# EAGLE design FRA_bulkhead_v1 (EAGLE 9.5.2)
CNAME: FRA universal bulkhead; CREVISION: 01
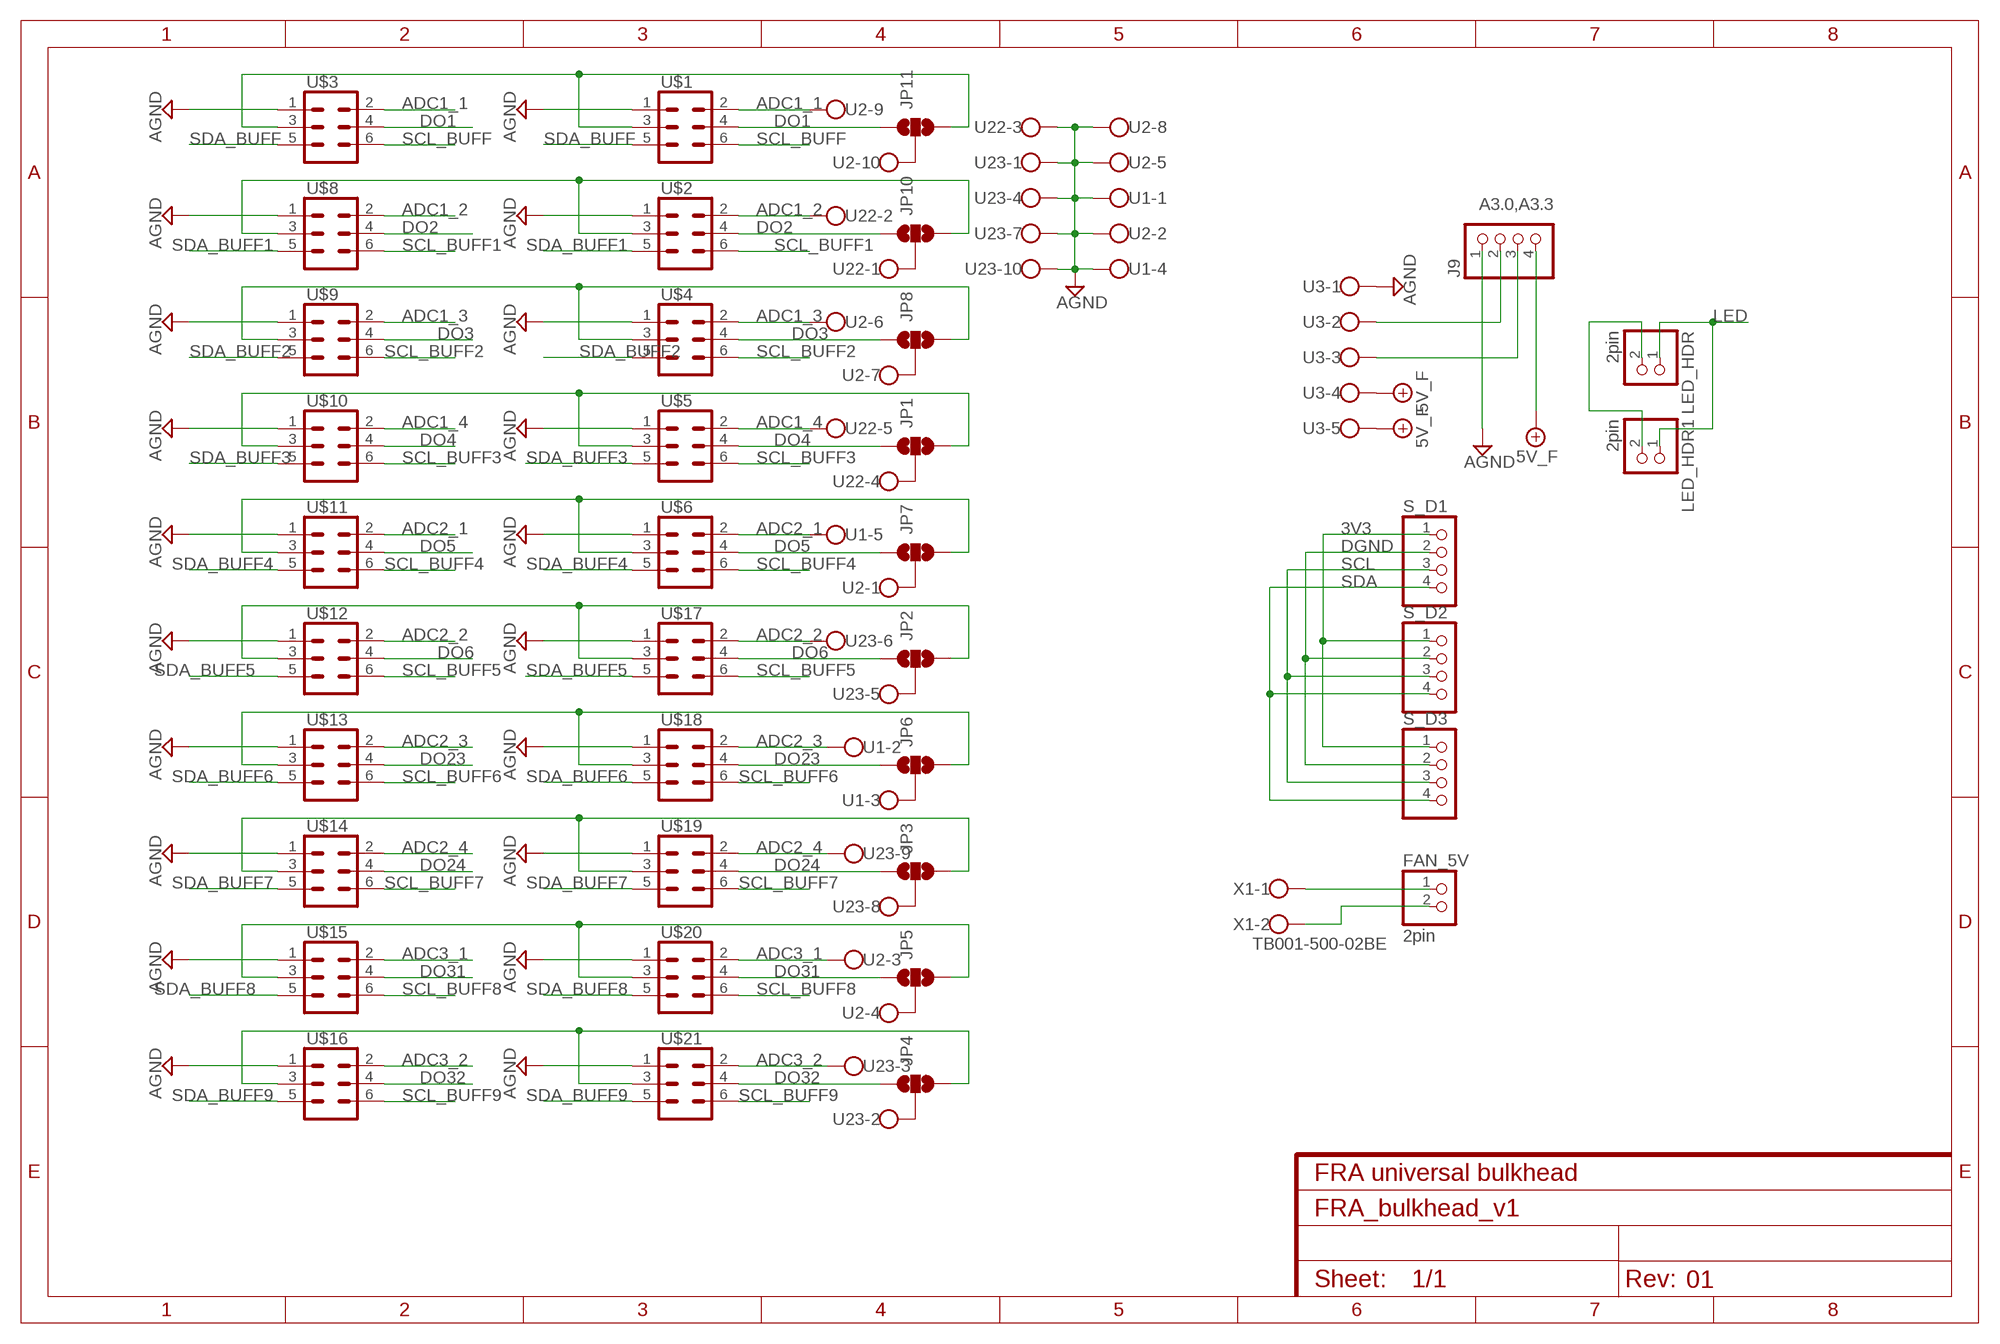
[diagram p0: schematic, sheet 1]

## Parts
FAN_5V  2pin  PINHD-1X2  [1X02]
J9  4pin  PINHD-1X4  [1X04]
JP1  JUMPER-SMT_3_NO_NO_SILK  [SMT-JUMPER_3_0-NO_TRACE_NO-SILK]
JP2  JUMPER-SMT_3_NO_NO_SILK  [SMT-JUMPER_3_0-NO_TRACE_NO-SILK]
JP3  JUMPER-SMT_3_NO_NO_SILK  [SMT-JUMPER_3_0-NO_TRACE_NO-SILK]
JP4  JUMPER-SMT_3_NO_NO_SILK  [SMT-JUMPER_3_0-NO_TRACE_NO-SILK]
JP5  JUMPER-SMT_3_NO_NO_SILK  [SMT-JUMPER_3_0-NO_TRACE_NO-SILK]
JP6  JUMPER-SMT_3_NO_NO_SILK  [SMT-JUMPER_3_0-NO_TRACE_NO-SILK]
JP7  JUMPER-SMT_3_NO_NO_SILK  [SMT-JUMPER_3_0-NO_TRACE_NO-SILK]
JP8  JUMPER-SMT_3_NO_NO_SILK  [SMT-JUMPER_3_0-NO_TRACE_NO-SILK]
JP10  JUMPER-SMT_3_NO_NO_SILK  [SMT-JUMPER_3_0-NO_TRACE_NO-SILK]
JP11  JUMPER-SMT_3_NO_NO_SILK  [SMT-JUMPER_3_0-NO_TRACE_NO-SILK]
LED_HDR  2pin  PINHD-1X2  [1X02]
LED_HDR1  2pin  PINHD-1X2  [1X02]
S_D1  4pin  PINHD-1X4  [1X04]
S_D2  4pin  PINHD-1X4  [1X04]
S_D3  4pin  PINHD-1X4  [1X04]
U1  TB003V-500-P05BERIGHTANGLE-NORMAL  [TB003-500-P05BE]
U2  TB003V-500-P10BERIGHTANGLE-NORMAL  [TB003-500-P10BE]
U3  TB003V-500-P05BERIGHTANGLE-NORMAL  [TB003-500-P05BE]
U22  TB003V-500-P05BERIGHTANGLE-NORMAL  [TB003-500-P05BE]
U23  TB003V-500-P10BERIGHTANGLE-NORMAL  [TB003-500-P10BE]
U$1  CONN_03X2_WE_61200621621  [WE_61200621621]
U$2  CONN_03X2_WE_61200621621  [WE_61200621621]
U$3  CONN_03X2_WE_61200621621  [WE_61200621621]
U$4  CONN_03X2_WE_61200621621  [WE_61200621621]
U$5  CONN_03X2_WE_61200621621  [WE_61200621621]
U$6  CONN_03X2_WE_61200621621  [WE_61200621621]
U$8  CONN_03X2_WE_61200621621  [WE_61200621621]
U$9  CONN_03X2_WE_61200621621  [WE_61200621621]
U$10  CONN_03X2_WE_61200621621  [WE_61200621621]
U$11  CONN_03X2_WE_61200621621  [WE_61200621621]
U$12  CONN_03X2_WE_61200621621  [WE_61200621621]
U$13  CONN_03X2_WE_61200621621  [WE_61200621621]
U$14  CONN_03X2_WE_61200621621  [WE_61200621621]
U$15  CONN_03X2_WE_61200621621  [WE_61200621621]
U$16  CONN_03X2_WE_61200621621  [WE_61200621621]
U$17  CONN_03X2_WE_61200621621  [WE_61200621621]
U$18  CONN_03X2_WE_61200621621  [WE_61200621621]
U$19  CONN_03X2_WE_61200621621  [WE_61200621621]
U$20  CONN_03X2_WE_61200621621  [WE_61200621621]
U$21  CONN_03X2_WE_61200621621  [WE_61200621621]
X1  TB001-500-02BE  W237-102  [W237-102]

## Nets
3V3: S_D1.1 S_D2.1 S_D3.1
+5V/1: J9.4 U3.4 U3.5 ; supply symbol labelled 5V_F
ADC1_1: U2.9 U$1.2 U$3.2
ADC1_2: U22.2 U$2.2 U$8.2
ADC1_3: U2.6 U$4.2 U$9.2
ADC1_4: U22.5 U$5.2 U$10.2
ADC2_1: U1.5 U$6.2 U$11.2
ADC2_2: U23.6 U$12.2 U$17.2
ADC2_3: U1.2 U$13.2 U$18.2
ADC2_4: U23.9 U$14.2 U$19.2
ADC3_1: U2.3 U$15.2 U$20.2
ADC3_2: U23.3 U$16.2 U$21.2
AGND: J9.1 U1.1 U1.4 U2.2 U2.5 U2.8 U3.1 U22.3 U23.1 U23.4 U23.7 U23.10 U$1.1 U$2.1 U$3.1 U$4.1 U$5.1 U$6.1 U$8.1 U$9.1 U$10.1 U$11.1 U$12.1 U$13.1 U$14.1 U$15.1 U$16.1 U$17.1 U$18.1 U$19.1 U$20.1 U$21.1
DGND: S_D1.2 S_D2.2 S_D3.2
DO1: JP11.1 U$1.4 U$3.4
DO2: JP10.1 U$2.4 U$8.4
DO3: JP8.1 U$4.4 U$9.4
DO4: JP1.1 U$5.4 U$10.4
DO5: JP7.1 U$6.4 U$11.4
DO6: JP2.1 U$12.4 U$17.4
DO23: JP6.1 U$13.4 U$18.4
DO24: JP3.1 U$14.4 U$19.4
DO31: JP5.1 U$15.4 U$20.4
DO32: JP4.1 U$16.4 U$21.4
LED: LED_HDR1.1 LED_HDR.1
N$1: FAN_5V.1 X1.1
N$2: FAN_5V.2 X1.2
N$3: JP1.2 U22.4
N$4: JP2.2 U23.5
N$5: JP3.2 U23.8
N$6: JP4.2 U23.2
N$7: JP10.2 U22.1
N$8: JP11.2 U2.10
N$9: JP8.2 U2.7
N$10: JP5.2 U2.4
N$11: JP7.2 U2.1
N$12: JP6.2 U1.3
N$13: JP11.3 U$1.3 U$3.3
N$14: J9.3 U3.3
N$15: JP10.3 U$2.3 U$8.3
N$16: J9.2 U3.2
N$17: JP8.3 U$4.3 U$9.3
N$18: JP1.3 U$5.3 U$10.3
N$19: JP7.3 U$6.3 U$11.3
N$20: JP2.3 U$12.3 U$17.3
N$21: JP6.3 U$13.3 U$18.3
N$22: JP3.3 U$14.3 U$19.3
N$23: JP5.3 U$15.3 U$20.3
N$24: JP4.3 U$16.3 U$21.3
N$26: LED_HDR1.2 LED_HDR.2
SCL: S_D1.3 S_D2.3 S_D3.3
SCL_BUFF: U$1.6 U$3.6
SCL_BUFF1: U$2.6 U$8.6
SCL_BUFF2: U$4.6 U$9.6
SCL_BUFF3: U$5.6 U$10.6
SCL_BUFF4: U$6.6 U$11.6
SCL_BUFF5: U$12.6 U$17.6
SCL_BUFF6: U$13.6 U$18.6
SCL_BUFF7: U$14.6 U$19.6
SCL_BUFF8: U$15.6 U$20.6
SCL_BUFF9: U$16.6 U$21.6
SDA: S_D1.4 S_D2.4 S_D3.4
SDA_BUFF: U$1.5 U$3.5
SDA_BUFF1: U$2.5 U$8.5
SDA_BUFF2: U$4.5 U$9.5
SDA_BUFF3: U$5.5 U$10.5
SDA_BUFF4: U$6.5 U$11.5
SDA_BUFF5: U$12.5 U$17.5
SDA_BUFF6: U$13.5 U$18.5
SDA_BUFF7: U$14.5 U$19.5
SDA_BUFF8: U$15.5 U$20.5
SDA_BUFF9: U$16.5 U$21.5

## Notes on the sheet
- A3.0,A3.3

## Library data of the parts
FAN_5V LED_HDR LED_HDR1 = pinhead:PINHD-1X2: PIN HEADER; PARTNO: TSW-102-07-G-S
J9 S_D1-S_D3 = pinhead:PINHD-1X4: PIN HEADER; PARTNO: 61300411121
JP1-JP8 JP10 JP11 = SparkFun-Jumpers:JUMPER-SMT_3_NO: Normally open jumper This jumper has three pads in close proximity to each other. Apply solder to close the connection(s).
U1 U3 U22 = SamacSys_Parts:TB003V-500-P05BE
U2 U23 = SamacSys_Parts:TB003V-500-P10BE
U$1-U$6 U$8-U$21 = FRA_eagle_lib:CONN_03X2_WE_61200621621: https://eu.mouser.com/ProductDetail/Wurth-Elektronik/61200621621?qs=sGAEpiMZZMs%252BGHln7q6pm%2FFhW%252BtWvhAgbNxkR%252BlwXp8Ip%2FAN9J9VOg%3D%3D https://eu.mouser.com/datasheet/2/445/6120xx21621-265830.pdf; PARTNO: 61200621621
X1 = con-wago-500:W237-102: WAGO SCREW CLAMP; MPN: 237-102; OC_FARNELL: unknown; OC_NEWARK: 70K9898; PARTNO: TB001-500-02BE

## Board
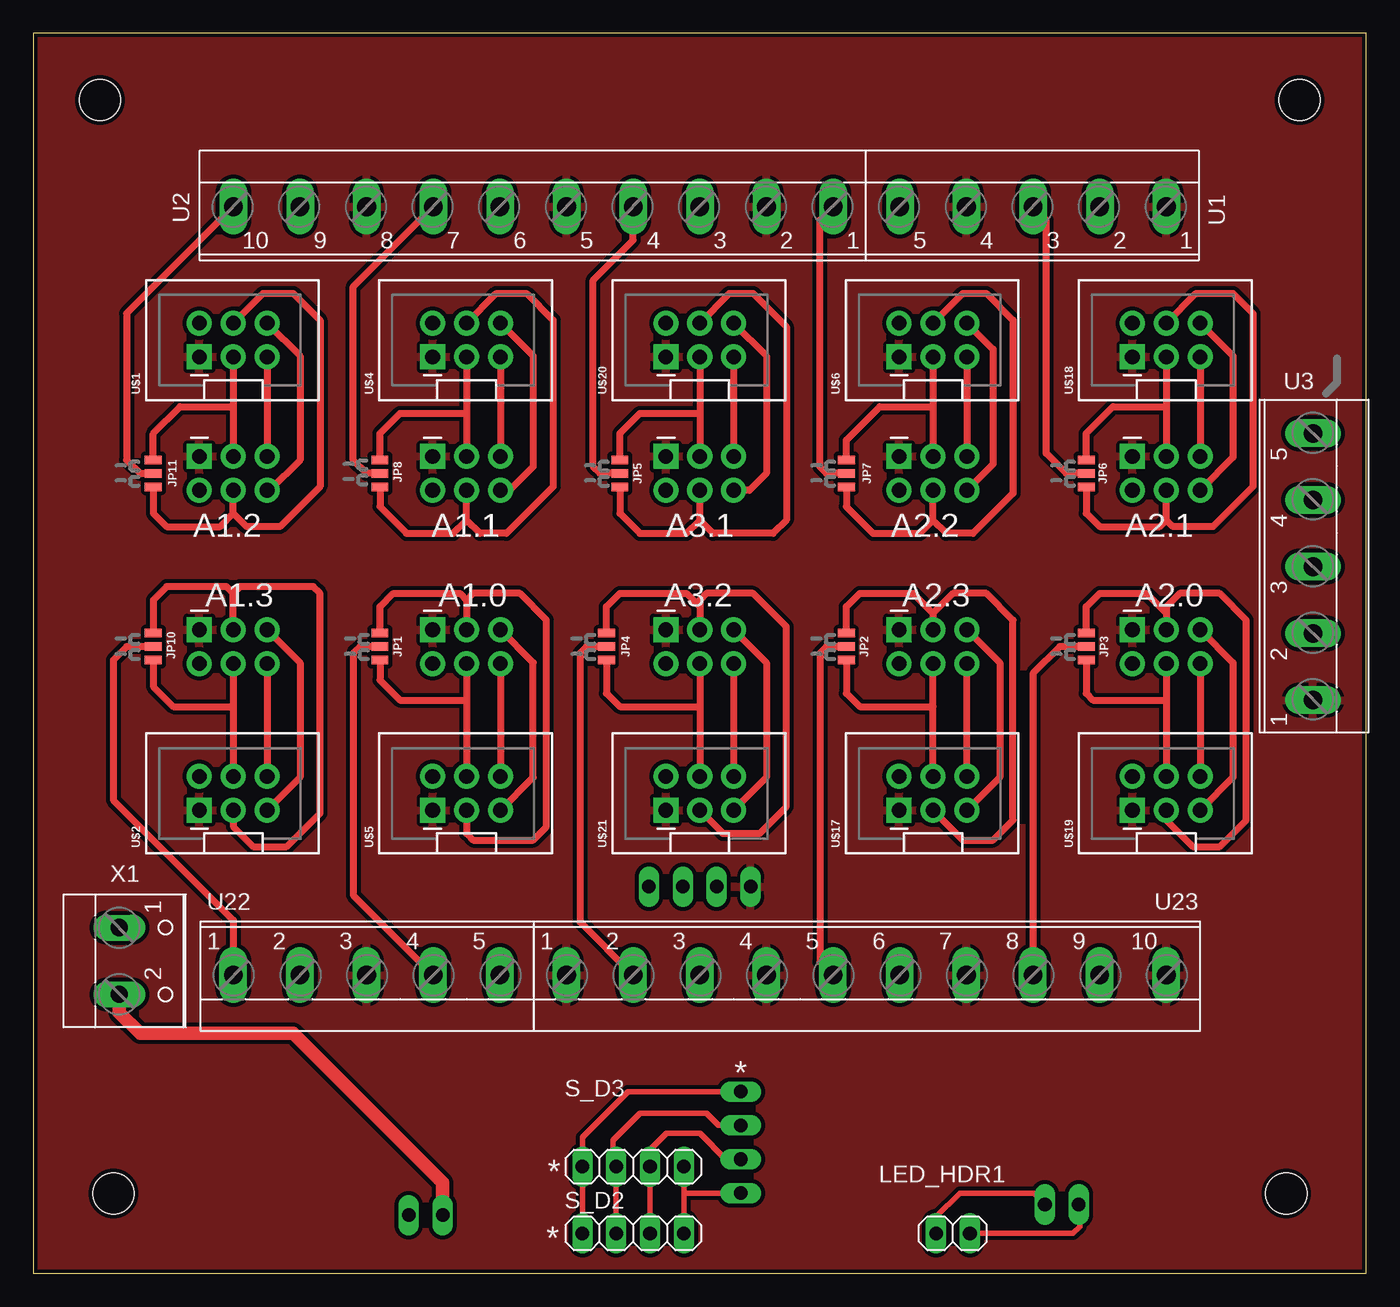
[diagram p1: board, top side]
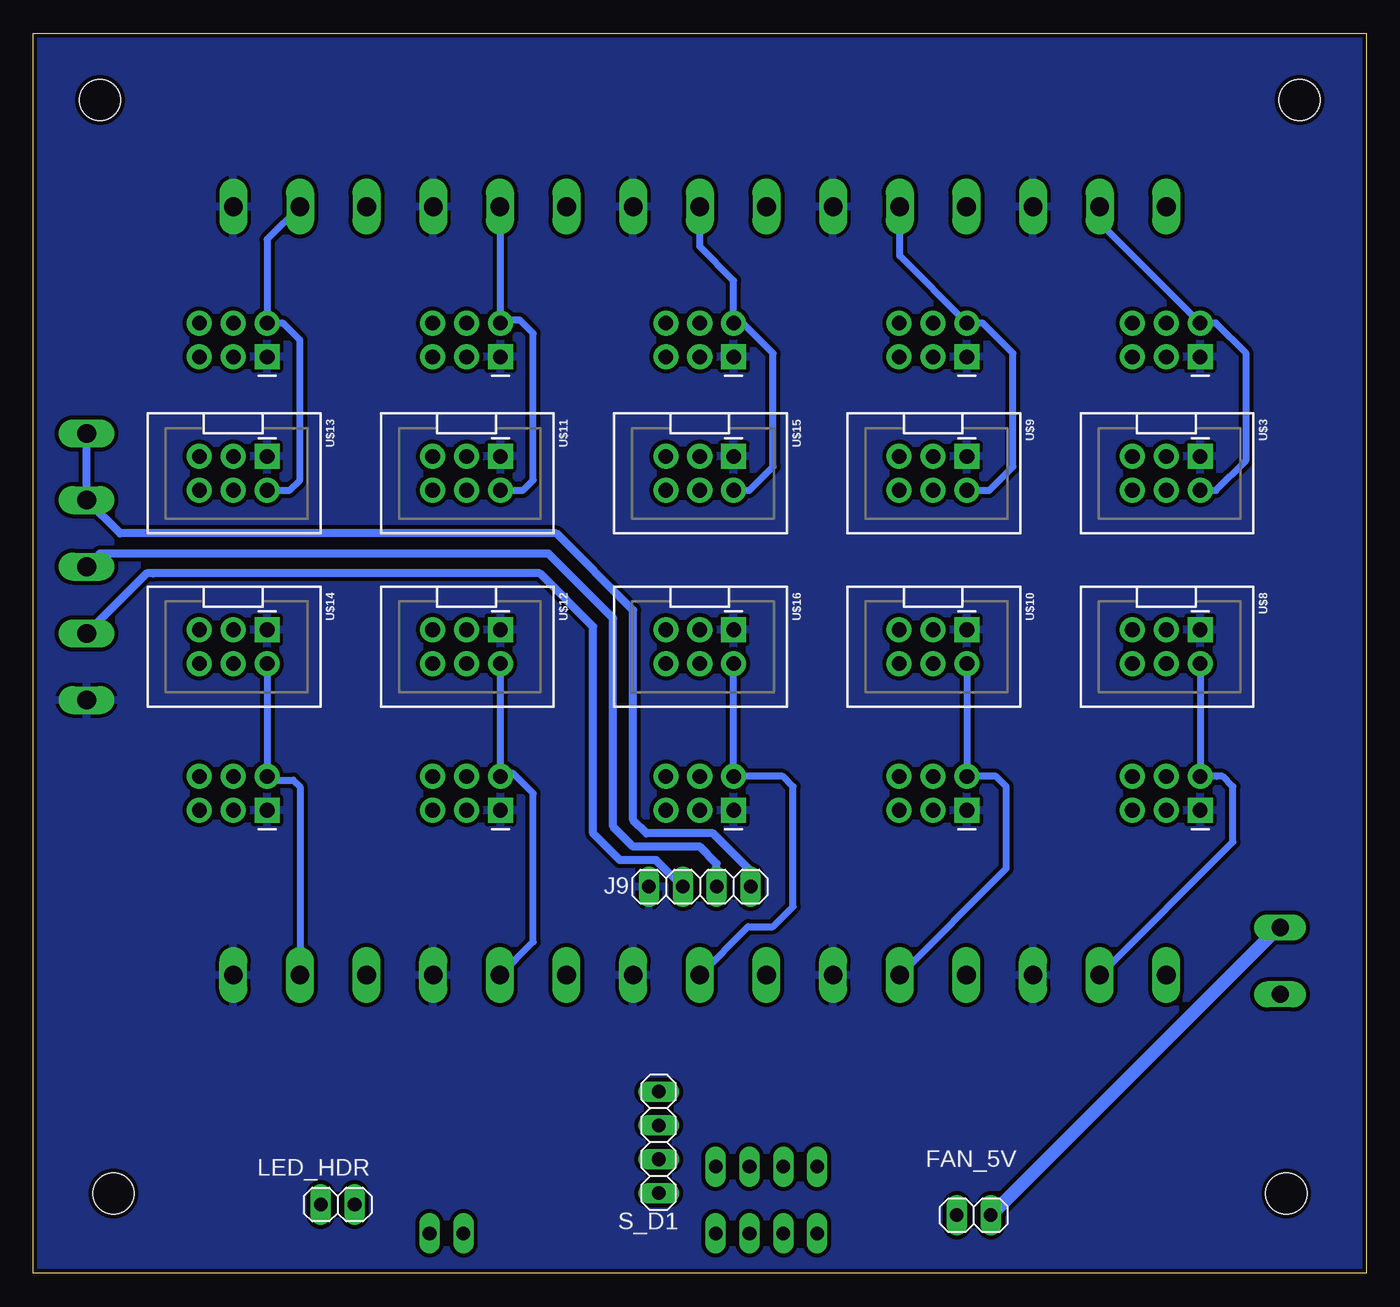
[diagram p2: board, bottom side, seen from below]

Size 100 x 93 mm. Coordinates in mm from the lower left corner, seen from the top.
Outline: 0,0 100,0 100,93 0,93 0,0
Copper layers (1*16): Top 0.035mm / dielectric 1.6mm / Bottom 0.035mm
Design rules "AllPCB": minimum track width 6mil, minimum drill 0.399mm, track to track 0.149859375mm, track to pad 0.149859375mm, pad to pad 8mil, via to via 17mil, smd to smd 6mil, copper to edge 10mil, drill to drill 24mil, minimum pad ring 10mil, minimum via ring 8mil, stop-mask expansion 4mil, vias tented up to drill 0.3mm, thermal gap 10mil
Holes 3.1 mm at 6,6 5,88 95,88 94,6
tKeepout: area 3.5,3.5 to 8.5,8.5; area 91.5,3.5 to 96.5,8.5; area 92.5,85.5 to 97.5,90.5; area 2.5,85.5 to 7.5,90.5

### Footprints (pad centres in the part's own frame; a part is rotated, then mirrored left to right if it is on the bottom)
1X02 = drill 1.016 long: 1 -1.27,0; 2 1.27,0
1X04 = drill 1.016 long: 1 -3.81,0; 2 -1.27,0; 3 1.27,0; 4 3.81,0
SMT-JUMPER_3_0-NO_TRACE_NO-SILK = smd 0.635 x 1.27: 1 -1.016,0; 2 0,0; 3 1.016,0
TB003-500-P05BE = drill 1.4 long: 1 0,0; 3 10,0; 4 15,0; 5 20,0 | drill 1.4 pad 1.93 long: 2 5,0
TB003-500-P10BE = drill 1.4 long: 1 0,0; 3 10,0; 4 15,0; 5 20,0; 6 25,0; 7 30,0; 8 35,0; 9 40,0; 10 45,0 | drill 1.4 pad 1.93 long: 2 5,0
WE_61200621621 = drill 1.1 pad 1.88 square: 1 -1.27,2.54 | drill 1.1 pad 1.88: 2 1.27,2.54; 3 -1.27,0; 4 1.27,0; 5 -1.27,-2.54; 6 1.27,-2.54
W237-102 = drill 1.3 long: 1 -2.5,-1.27; 2 2.5,-1.27

### Placement (x,y rotation side)
FAN_5V  29.44,4.36 180 bottom
J9  50,29 0 bottom
JP1  26,47 90 top
JP2  61,47 90 top
JP3  79,47 90 top
JP4  43,47 90 top
JP5  44,60 90 top
JP6  79,60 90 top
JP7  61,60 90 top
JP8  26,60 90 top
JP10  9,47 90 top
JP11  9,60 90 top
LED_HDR  77.17,5.16 0 bottom
LED_HDR1  69,3 180 top
S_D1  53.09,9.83 270 bottom
S_D2  45,3 0 top
S_D3  45,8 0 top
U1  85,80 180 top
U2  60,80 180 top
U3  96,43 90 top
U22  15,22.37 0 top
U23  40,22.37 0 top
U$1  15,70 90 top
U$2  15,36 90 top
U$3  15,60 270 bottom
U$4  32.5,70 90 top
U$5  32.5,36 90 top
U$6  67.5,70 90 top
U$8  15,47 270 bottom
U$9  32.5,60 270 bottom
U$10  32.5,47 270 bottom
U$11  67.5,60 270 bottom
U$12  67.5,47 270 bottom
U$13  85,60 270 bottom
U$14  85,47 270 bottom
U$15  50,60 270 bottom
U$16  50,47 270 bottom
U$17  67.5,36 90 top
U$18  85,70 90 top
U$19  85,36 90 top
U$20  50,70 90 top
U$21  50,36 90 top
X1  7.71,23.43 270 top

### Tracks (layer width: path | path; a pad name or v marks a point on that pad's centre or on a via)
3V3
  Top 0.406: S_D2.1 S_D3.1 41.19,10.19 44.64,13.64 S_D1.1
+5V/1
  Bottom 0.61: J9.4 46.19,30.19 49,33 54,33 55,34 55,49.74 60.76,55.5 93.5,55.5 U3.4 U3.5
ADC1_1
  Bottom 0.508: U$3.2 11.27,58.73 9,61 9,69 11.27,71.27 U$1.2 20,78.81 U2.9
ADC1_2
  Bottom 0.508: 11.23,37.27 U$2.2 | U22.2 10,32.37 10,36.5 10.77,37.27 U$2.2 | U$8.2 U$2.2
ADC1_3
  Bottom 0.508: U$9.2 28.27,58.73 26.5,60.5 26.5,69 28.77,71.27 U$4.2 35,76.31 U2.6
ADC1_4
  Bottom 0.508: U$10.2 U$5.2 27.77,37.27 27,36.5 27,30.37 U22.5
ADC2_1
  Bottom 0.508: U$11.2 63.27,58.73 62.5,59.5 62.5,70.5 63.5,71.5 64.73,71.5 U$6.2 65,71.31 U1.5
ADC2_2
  Bottom 0.508: U$17.2 64.96,37.5 | 64.96,37.5 U$12.2 | U23.6 62.5,24.87 62.5,36 64,37.5 64.96,37.5
ADC2_3
  Bottom 0.508: U$13.2 80.77,58.73 80,59.5 80,70 81.27,71.27 U$18.2 82.46,77.54 U1.2
ADC2_4
  Bottom 0.508: U$14.2 U$19.2 82.19,37 80.5,37 80,36.5 U23.9
ADC3_1
  Bottom 0.508: U$15.2 46.27,58.73 44.5,60.5 44.5,69 46.77,71.27 U$20.2 47.46,74.46 50,77 U2.3
ADC3_2
  Bottom 0.508: U$16.2 U$21.2 43.77,37.27 43,36.5 43,27.5 44.5,26 46.37,26 U23.3
AGND
  pour Bottom (isolate 0.3): -10.5,102 110.5,102 110.5,-6 -10.5,-6
  pour Top (isolate 0.3): -14.5,107 116.5,107 116.5,-11 -14.5,-11
DGND
  Top 0.406: S_D2.2 S_D3.2 43.5,8.23 43.5,10 45.5,12 50.5,12 51.4,11.1 S_D1.2
DO1
  Top 0.508: JP11.1 9,57 10,56 14,56 15,57 | 15,57 U$3.4 | U$1.4 17.23,73.5 19.5,73.5 21.5,71.5 21.5,59 18.5,56 16,56 15,57
DO2
  Top 0.508: U$8.4 15,42.5 | 15,42.5 U$2.4 | JP10.1 9,44 10.5,42.5 15,42.5
DO3
  Top 0.508: JP8.1 26,57.5 28,55.5 31.5,55.5 32.5,56.5 | 32.5,56.5 U$9.4 | U$4.4 34.73,73.5 37,73.5 39,71.5 39,59 35.5,55.5 33.5,55.5 32.5,56.5
DO4
  Top 0.508: U$10.4 32.5,43 | 32.5,43 U$5.4 | JP1.1 26,44.5 27.5,43 32.5,43
DO5
  Top 0.508: JP7.1 61,57.5 63,55.5 66.5,55.5 67.5,56.5 | 67.5,56.5 U$11.4 | U$6.4 69.73,73.5 71.5,73.5 73.5,71.5 73.5,58.5 70.5,55.5 68.5,55.5 67.5,56.5
DO6
  Top 0.508: JP2.1 61,43.5 62,42.5 67.5,42.5 | 67.5,42.5 U$12.4 | U$17.4 67.5,42.5
DO23
  Top 0.508: U$18.4 87.23,73.5 90,73.5 91.5,72 91.5,59 88.5,56 85.5,56 85,56.5 | 85,56.5 U$13.4 | JP6.1 79,57 80,56 84.5,56 85,56.5
DO24
  Top 0.508: U$14.4 85,43 | 85,43 U$19.4 | JP3.1 79,43.5 79.5,43 85,43
DO31
  Top 0.508: JP5.1 44,57 45.5,55.5 49,55.5 50,56.5 | 50,56.5 U$15.4 | U$20.4 52.23,73.5 54,73.5 56.5,71 56.5,56.5 55.5,55.5 51,55.5 50,56.5
DO32
  Top 0.508: U$16.4 50,42.5 | 50,42.5 U$21.4 | JP4.1 43,43.5 44,42.5 50,42.5
LED
  Top 0.406: LED_HDR1.1 78,3 78.5,3.5 78.5,5.09 LED_HDR.1
N$1
  Bottom 1.016: FAN_5V.1 6.6,25.93 X1.1
N$2
  Top 1.016: FAN_5V.2 30.71,6.79 19.5,18 8,18 6.45,19.55 X1.2
N$3
  Top 0.508: JP1.2 24.5,47 24,46.5 24,28.37 U22.4
N$4
  Top 0.508: JP2.2 59.5,47 59,46.5 59,23.37 U23.5
N$5
  Top 0.508: U23.8 75,45 77,47 JP3.2
N$6
  Top 0.508: JP4.2 41.5,47 41,46.5 41,26.37 U23.2
N$7
  Top 0.508: JP10.2 7,47 6,46 6,35.5 15,26.5 U22.1
N$8
  Top 0.508: U2.10 7,72 7,61 8,60 JP11.2
N$9
  Top 0.508: JP8.2 25,60 24,61 24,74 U2.7
N$10
  Top 0.508: JP5.2 42.5,60 42,60.5 42,74.5 45,77.5 U2.4
N$11
  Top 0.508: JP7.2 59.5,60 59,60.5 59,79 U2.1
N$12
  Top 0.508: JP6.2 77.5,60 76,61.5 76,79 U1.3
N$13
  Top 0.508: U$1.3 15,65 | 15,65 U$3.3 | JP11.3 9,63 11,65 15,65
N$14
  Bottom 0.61: J9.3 48.73,30.73 50,32 55,32 56.5,33.5 56.5,49.12 61.38,54 95,54 U3.3
N$15
  Top 0.508: U$8.3 15,51 | 15,51 14.5,51.5 10,51.5 9,50.5 JP10.3 | U$2.3 15,33.5 16.5,32 19,32 21.5,34.5 21.5,51 21,51.5 15.5,51.5 15,51
N$16
  Bottom 0.61: J9.2 53.27,31 56,31 58,33 58,48.5 62,52.5 91,52.5 91.5,52.5 U3.2
N$17
  Top 0.508: U$4.3 32.5,64.5 | 32.5,64.5 U$9.3 | JP8.3 26,63 27.5,64.5 32.5,64.5
N$18
  Top 0.508: JP1.3 26,50 27,51 32,51 32.5,50.5 | 32.5,50.5 U$10.3 | U$5.3 32.5,33 33,32.5 37.5,32.5 38.5,33.5 38.5,49 36.5,51 33,51 32.5,50.5
N$19
  Top 0.508: U$6.3 67.5,65 | 67.5,65 U$11.3 | JP7.3 61,62.5 63.5,65 67.5,65
N$20
  Top 0.508: JP2.3 61,50 62,51 66,51 67.5,49.5 | 67.5,49.5 U$12.3 | U$17.3 69.73,32.5 72,32.5 73.5,34 73.5,49 71.5,51 69,51 67.5,49.5
N$21
  Top 0.508: U$18.3 85,65 | 85,65 U$13.3 | JP6.3 79,63 81,65 85,65
N$22
  Top 0.508: JP3.3 79,50 80,51 83.5,51 85,49.5 | 85,49.5 U$14.3 | U$19.3 85,34 87,32 89,32 91,34 91,49 89,51 86,51 85,50 85,49.5
N$23
  Top 0.508: U$20.3 50,64.5 | 50,64.5 U$15.3 | JP5.3 44,63 45.5,64.5 50,64.5
N$24
  Top 0.508: JP4.3 43,50 44,51 49,51 50,50 | 50,50 U$16.3 | U$21.3 51.73,33 54.5,33 56.5,35 56.5,48.5 54,51 50.5,51 50,50.5 50,50
N$26
  Top 0.406: LED_HDR.2 75.06,6 69.5,6 67.73,4.23 LED_HDR1.2
SCL
  Top 0.406: S_D2.3 S_D3.3 46.27,9.27 47.5,10.5 50,10.5 51.94,8.56 S_D1.3
SCL_BUFF
  Top 0.508: U$1.6 20,68.81 20,61 17.73,58.73 U$3.6
SCL_BUFF1
  Top 0.508: U$8.6 U$2.6
SCL_BUFF2
  Top 0.508: U$4.6 37.5,68.81 37.5,60.5 35.73,58.73 U$9.6
SCL_BUFF3
  Top 0.508: U$10.6 U$5.6
SCL_BUFF4
  Top 0.508: U$6.6 72,69.31 72,60.69 U$11.6
SCL_BUFF5
  Top 0.508: U$17.6 U$12.6
SCL_BUFF6
  Top 0.508: U$18.6 90,68.81 90,61.19 U$13.6
SCL_BUFF7
  Top 0.508: U$14.6 U$19.6
SCL_BUFF8
  Top 0.508: U$20.6 55,68.81 55,60 53.73,58.73 U$15.6
SCL_BUFF9
  Top 0.508: U$16.6 U$21.6
SDA
  Top 0.406: S_D2.4 48.81,6 | 48.81,6 S_D3.4 | S_D1.4 48.83,6.02 48.81,6
SDA_BUFF
  Top 0.508: U$1.5 U$3.5
SDA_BUFF1
  Top 0.508: U$8.5 20,45.81 20,37.19 U$2.5
SDA_BUFF2
  Top 0.508: U$4.5 U$9.5
SDA_BUFF3
  Top 0.508: U$10.5 37.5,45.81 37.5,37.19 U$5.5
SDA_BUFF4
  Top 0.508: U$6.5 U$11.5
SDA_BUFF5
  Top 0.508: U$12.5 72.5,45.81 72.5,37.19 U$17.5
SDA_BUFF6
  Top 0.508: U$18.5 U$13.5
SDA_BUFF7
  Top 0.508: U$14.5 90,45.81 90,37.19 U$19.5
SDA_BUFF8
  Top 0.508: U$20.5 U$15.5
SDA_BUFF9
  Top 0.508: U$16.5 55,45.81 55,37.19 U$21.5

### Text on the board
tNames: A1.2 | A1.1 | A3.1 | A2.2 | A2.1 | A1.3 | A1.0 | A3.2 | A2.3 | A2.0 | * | * | *
tDocu: FRA universal bulkhead v1 | +5V A1.1 GND +5V A1.3 GND +5V A3.1 GND +5V A2.1 GND +5V A2.3 GND | +5V/2A / Power | Power selection / +5V 100mA low noise / +5V 2A power / sum current for all outputs | GND A3.3 A3.0 +5V +5V | 100mA / / 2A | 100mA / / 2A | 100mA / / 2A | 100mA / / 2A | 100mA / / 2A | solder bridge / only one option | 100mA / / 2A | 100mA / / 2A | 100mA / / 2A | 100mA / / 2A | 100mA / / 2A | GND +5V | (FAN) | +5V A1.2 GND +5V A1.4 GND +5V A3.2 GND +5V A2.2 GND +5V A2.4 GND | Electronics design solutions s.r.o. | J.Repcik / 03/2020 | 3V3 | GND | SCL | SDA | LED+ | LED-
bDocu: GND | 5V | SDA_5V | ADC | SCL_5V | 5V / HiZ | 3V3 | GND | SCL | +5V | - | SDA | LED- | LED+